# Altium project powersupply_grid8.PrjPcb
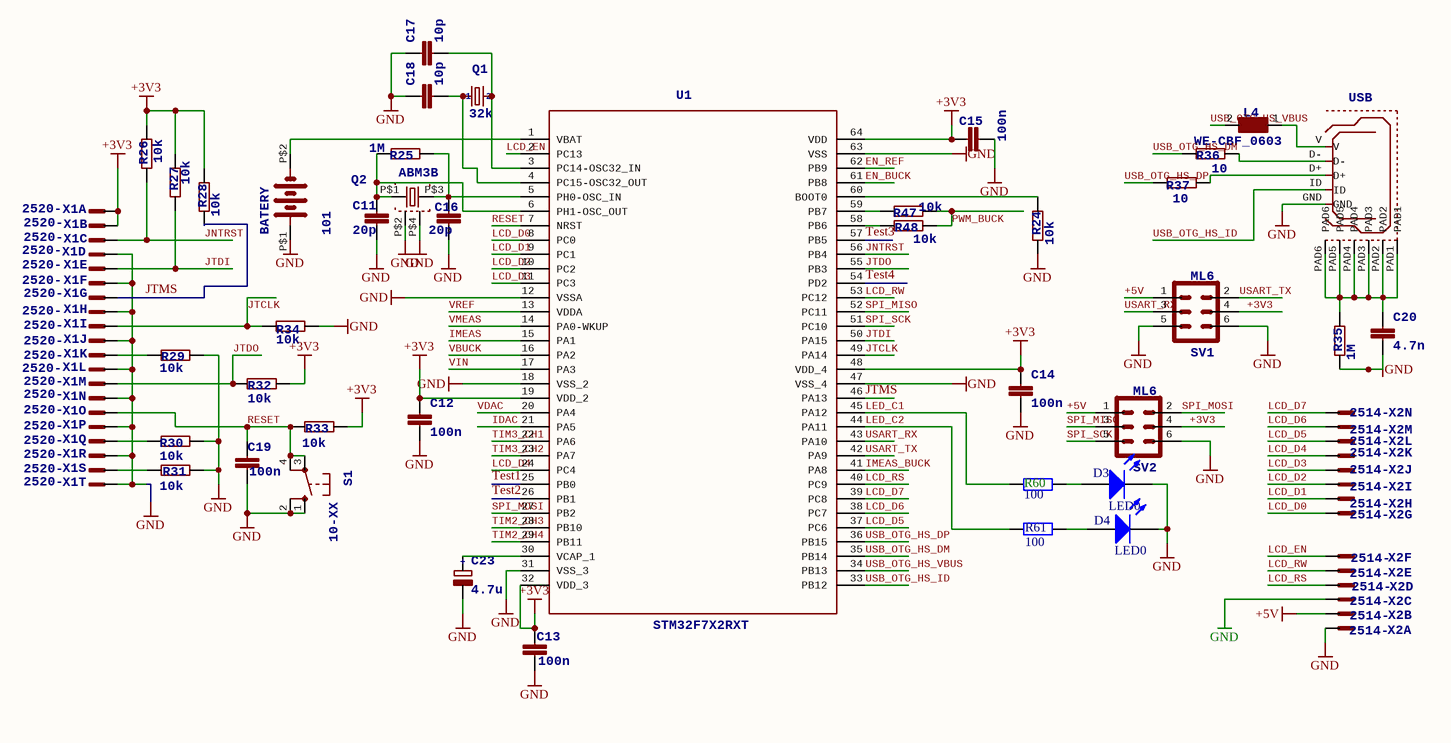
[diagram p0: powersupply_grid8_1.SchDoc]
1 sheet, 42 parts. Net scope: global (net labels, ports and power ports of the same name join across sheets).
Board file: powersuppy.PcbDoc

## Sheet powersupply_grid8_1.SchDoc: powersupply_grid8.sch
size 409 x 282 mm; Date: 12/19/2018 10:57:12 PM; SheetNumber: Sheet:

### Parts
BATERY  101  [KEYSTONE101]
C11  20p  [C0402]
C12  100n  [C0402]
C13  100n  [C0603]
C14  100n  [C0402]
C15  100n  [C0402]
C16  20p  [C0402]
C17  10p  [C0402]
C18  10p  [C0402]
C19  100n  [C0402]
C20  4.7n  [C0805]
C23  4.7u  [C0805]
D3  LED0  [LED-0]
D4  LED0  [LED-0]
L4  WE-CBF_0603  [0603]
Q1  32k  [TC26V]
Q2  ABM3B  [ABM3B]
R24  10k  [R0805]
R25  1M  [R0402]
R26  10k  [R0805]
R27  10k  [R0805]
R28  10k  [R0805]
R29  10k  [R0805]
R30  10k  [R0805]
R31  10k  [R0805]
R32  10k  [R0805]
R33  10k  [R0805]
R34  10k  [R0805]
R35  1M  [R0805]
R36  10  [R0805]
R37  10  [R0805]
R47  10k  [R0805]
R48  10k  [R0805]
R60  value 100  [6-0805_L]  (hidden comment: Res2)
R61  value 100  [6-0805_L]  (hidden comment: Res2)
S1  10-XX  [B3F-10XX]
SV1  ML6  [ML6]
SV2  ML6  [ML6]
U1  STM32F7X2RXT  [LQFP64-10X10MM]
U$6  USB_MICROB  [USB_MICROB_PACKAGE]  (value not drawn)
X1  2520-  [PAK100/2500-20]  (parts A,B,C,D,E,F,G,H,I,J,K,L,M,N,O,P,Q,R,S,T of 20)
X2  2514-  [PAK100/2500-14]  (parts A,B,C,D,E,F,G,H,I,J,K,L,M,N of 14)

### Nets
+3V3: C12.1 C13.1 C14.1 C15.1 R26.2 R27.2 R28.2 R32.1 R33.1 SV1.4 SV2.4 U1.19(VDD_2) U1.32(VDD_3) U1.48(VDD_4) U1.64(VDD) X1.1(KL) X1.2(KL)
+5V: SV1.1 SV2.1 X2.2(KL)
GND: BATERY.P$1(+) C11.2 C12.2 C13.2 C14.2 C15.2 C16.2 C17.1 C18.1 C19.2 C20.2 C23.- D3.2(K) D4.2(K) Q2.P$2 Q2.P$4 R24.1 R29.1 R30.1 R31.1 R34.1 R35.1 S1.1(S) S1.2(S1) SV1.5 SV1.6 SV2.6 U1.12(VSSA) U1.18(VSS_2) U1.31(VSS_3) U1.47(VSS_4) U1.63(VSS) U$6.GND X1.4(KL) X1.6(KL) X1.8(KL) X1.10(KL) X1.12(KL) X1.14(KL) X1.16(KL) X1.18(KL) X1.20(KL) X2.1(KL) X2.3(KL)
EN_BUCK: U1.61(PB8)
EN_REF: U1.62(PB9)
IDAC: U1.21(PA5)
IMEAS: U1.15(PA1)
IMEAS_BUCK: U1.41(PA8)
JNTRST: R26.1 U1.56(PB4) X1.3(KL)
JTCLK: R34.2 U1.49(PA14) X1.9(KL)
JTDI: R27.1 U1.50(PA15) X1.5(KL)
JTDO: R32.2 U1.55(PB3) X1.13(KL)
JTMS: R28.1 U1.46(PA13) X1.7(KL)
LCD_D0: U1.8(PC0) X2.7(KL)
LCD_D1: U1.9(PC1) X2.8(KL)
LCD_D2: U1.10(PC2) X2.9(KL)
LCD_D3: U1.11(PC3) X2.10(KL)
LCD_D4: U1.24(PC4) X2.11(KL)
LCD_D5: U1.37(PC6) X2.12(KL)
LCD_D6: U1.38(PC7) X2.13(KL)
LCD_D7: U1.39(PC8) X2.14(KL)
LCD_EN: U1.2(PC13) X2.6(KL)
LCD_RS: U1.40(PC9) X2.4(KL)
LCD_RW: U1.53(PC12) X2.5(KL)
LED_C1: R60.1 U1.45(PA12)
LED_C2: R61.1 U1.44(PA11)
PWM_BUCK: R47.1 R48.1
RESET: C19.1 R33.2 S1.3(P) S1.4(P1) U1.7(NRST) X1.15(KL)
SPI_MISO: SV2.3 U1.52(PC11)
SPI_MOSI: SV2.2 U1.27(PB2)
SPI_SCK: SV2.5 U1.51(PC10)
Test1: U1.25(PB0)
Test2: U1.26(PB1)
Test3: U1.57(PB5)
Test4: U1.54(PD2)
TIM2_CH3: U1.28(PB10)
TIM2_CH4: U1.29(PB11)
TIM3_CH1: U1.22(PA6)
TIM3_CH2: U1.23(PA7)
USART_RX: SV1.3 U1.43(PA10)
USART_TX: SV1.2 U1.42(PA9)
USB_OTG_HS_DM: R36.2 U1.35(PB14)
USB_OTG_HS_DP: R37.2 U1.36(PB15)
USB_OTG_HS_ID: U1.33(PB12) U$6.ID
USB_OTG_HS_VBUS: L4.2 U1.34(PB13)
VBUCK: U1.16(PA2)
VDAC: U1.20(PA4)
VIN: U1.17(PA3)
VMEAS: U1.14(PA0-WKUP)
VREF: U1.13(VDDA)
NetBATERY_P$2: BATERY.P$2(-) U1.1(VBAT)
NetC11_1: C11.1 Q2.P$1 R25.2 U1.6(PH1-OSC_OUT)
NetC16_1: C16.1 Q2.P$3 R25.1 U1.5(PH0-OSC_IN)
NetC17_2: C17.2 Q1.2 U1.3(PC14-OSC32_IN)
NetC18_2: C18.2 Q1.1 U1.4(PC15-OSC32_OUT)
NetC20_1: C20.1 R35.2 U$6.PAD1 U$6.PAD2 U$6.PAD3 U$6.PAD4 U$6.PAD5 U$6.PAD6
NetC23_+: C23.+ U1.30(VCAP_1)
NetD3_1: D3.1(A) R60.2
NetD4_1: D4.1(A) R61.2
NetL4_1: L4.1 U$6.V
NetR24_2: R24.2 U1.60(BOOT0)
NetR29_2: R29.2 X1.11(KL)
NetR30_2: R30.2 X1.17(KL)
NetR31_2: R31.2 X1.19(KL)
NetR36_1: R36.1 U$6.D-
NetR37_1: R37.1 U$6.D+
NetR47_2: R47.2 U1.59(PB7)
NetR48_2: R48.2 U1.58(PB6)

### Notes on the sheet
- 1
- 2
- 3
- 4
- 5
- 6
- 7
- 8
- A
- B
- C
- D
- E

### Library data of the parts
C11 C12 C14-C19 = C-EUC0402: <B>CAPACITOR</B>, European symbol; SPICEPREFIX: C
C13 = C-EUC0603: <B>CAPACITOR</B>, European symbol; SPICEPREFIX: C
C20 = C-EUC0805: <B>CAPACITOR</B>, European symbol; SPICEPREFIX: C
C23 = CPOL-EUE2.5-7: <B>POLARIZED CAPACITOR</B>, European symbol; +: +
D3 D4 = LED0: Typical INFRARED GaAs LED; Published: 8-Jun-2000; LatestRevisionDate: 08-Jul-2005; LatestRevisionNote: Mech Layer 1 removed.; PackageReference: LED-0; Publisher: Altium Limited; PackageDescription: LED; 2 Leads
L4 = WE-CBF_0603: <b> SMD EMI Suppression Ferrite Beads WE-CBF</b> <p> / - Excellent anti-EMI properties <br> / - Low DC-restistance <br> / - Impedances till 3000 ohms <br> / - Rated current up to 6 A<p> / -- Reliable Ni-Sn electrodes<br> / -- Perfect as data lined filter and for uncoupling of distribution voltage<br>; MPN: 742792695; OC_FARNELL: 1635699; OC_NEWARK: 08P2449; PACKAGE: IND-0603; SUPPLIER: Wuerth Elektronik
Q1 = CRYSTALTC26V: <b>CRYSTAL</b>; OC_FARNELL: unknown; OC_NEWARK: unknown; 1: 1; 2: 2
R24 R26-R37 R47 R48 = R-EU_R0805: <B>RESISTOR</B>, European symbol
R25 = R-EU_R0402: <B>RESISTOR</B>, European symbol
R60 R61 = Res2: Resistor; Published: 8-Jun-2000; LatestRevisionDate: 17-Jul-2002; LatestRevisionNote: Re-released for DXP Platform.; PackageReference: AXIAL-0.4; Publisher: Altium Limited; PackageDescription: Axial Device, Thru-Hole; 2 Leads; 0.4 in Pin Spacing
S1 = 10-XX: <b>OMRON SWITCH</b>; MPN: B3F-1000; OC_FARNELL: 176432; OC_NEWARK: 36M3542
SV1 SV2 = ML6: <b>HARTING</b>; OC_FARNELL: unknown; OC_NEWARK: unknown
U1 = STM32F7X2RXT: VENDOR: STMicroelectronics; MANUFACTURER_PART_NUMBER: stm32f7x2rxt
U$6 = USB_MICROB: This is the hirose ZX62-B-5PA(11) MICRO-USB B Type female connection.; USB: USB
X1 = 2520-: <b>3M (TM) Pak 100 4-Wall Header</b><p> / Source: 3M; OC_FARNELL: unknown; OC_NEWARK: unknown
X2 = 2514-: <b>3M (TM) Pak 100 4-Wall Header</b><p> / Source: 3M; OC_FARNELL: unknown; OC_NEWARK: unknown